# Altium schematic sheet Motion_Detector_Atmega64.SCHDOC
size 594 x 420 mm; SheetNumber: 1; SheetTotal: 1; DocumentName: Sheet1.SCHDOC
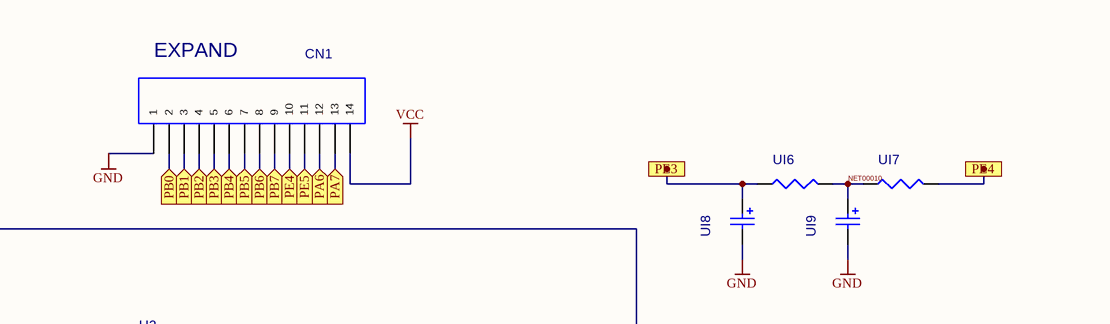
[diagram p0: Motion_Detector_Atmega64.SCHDOC, top right]
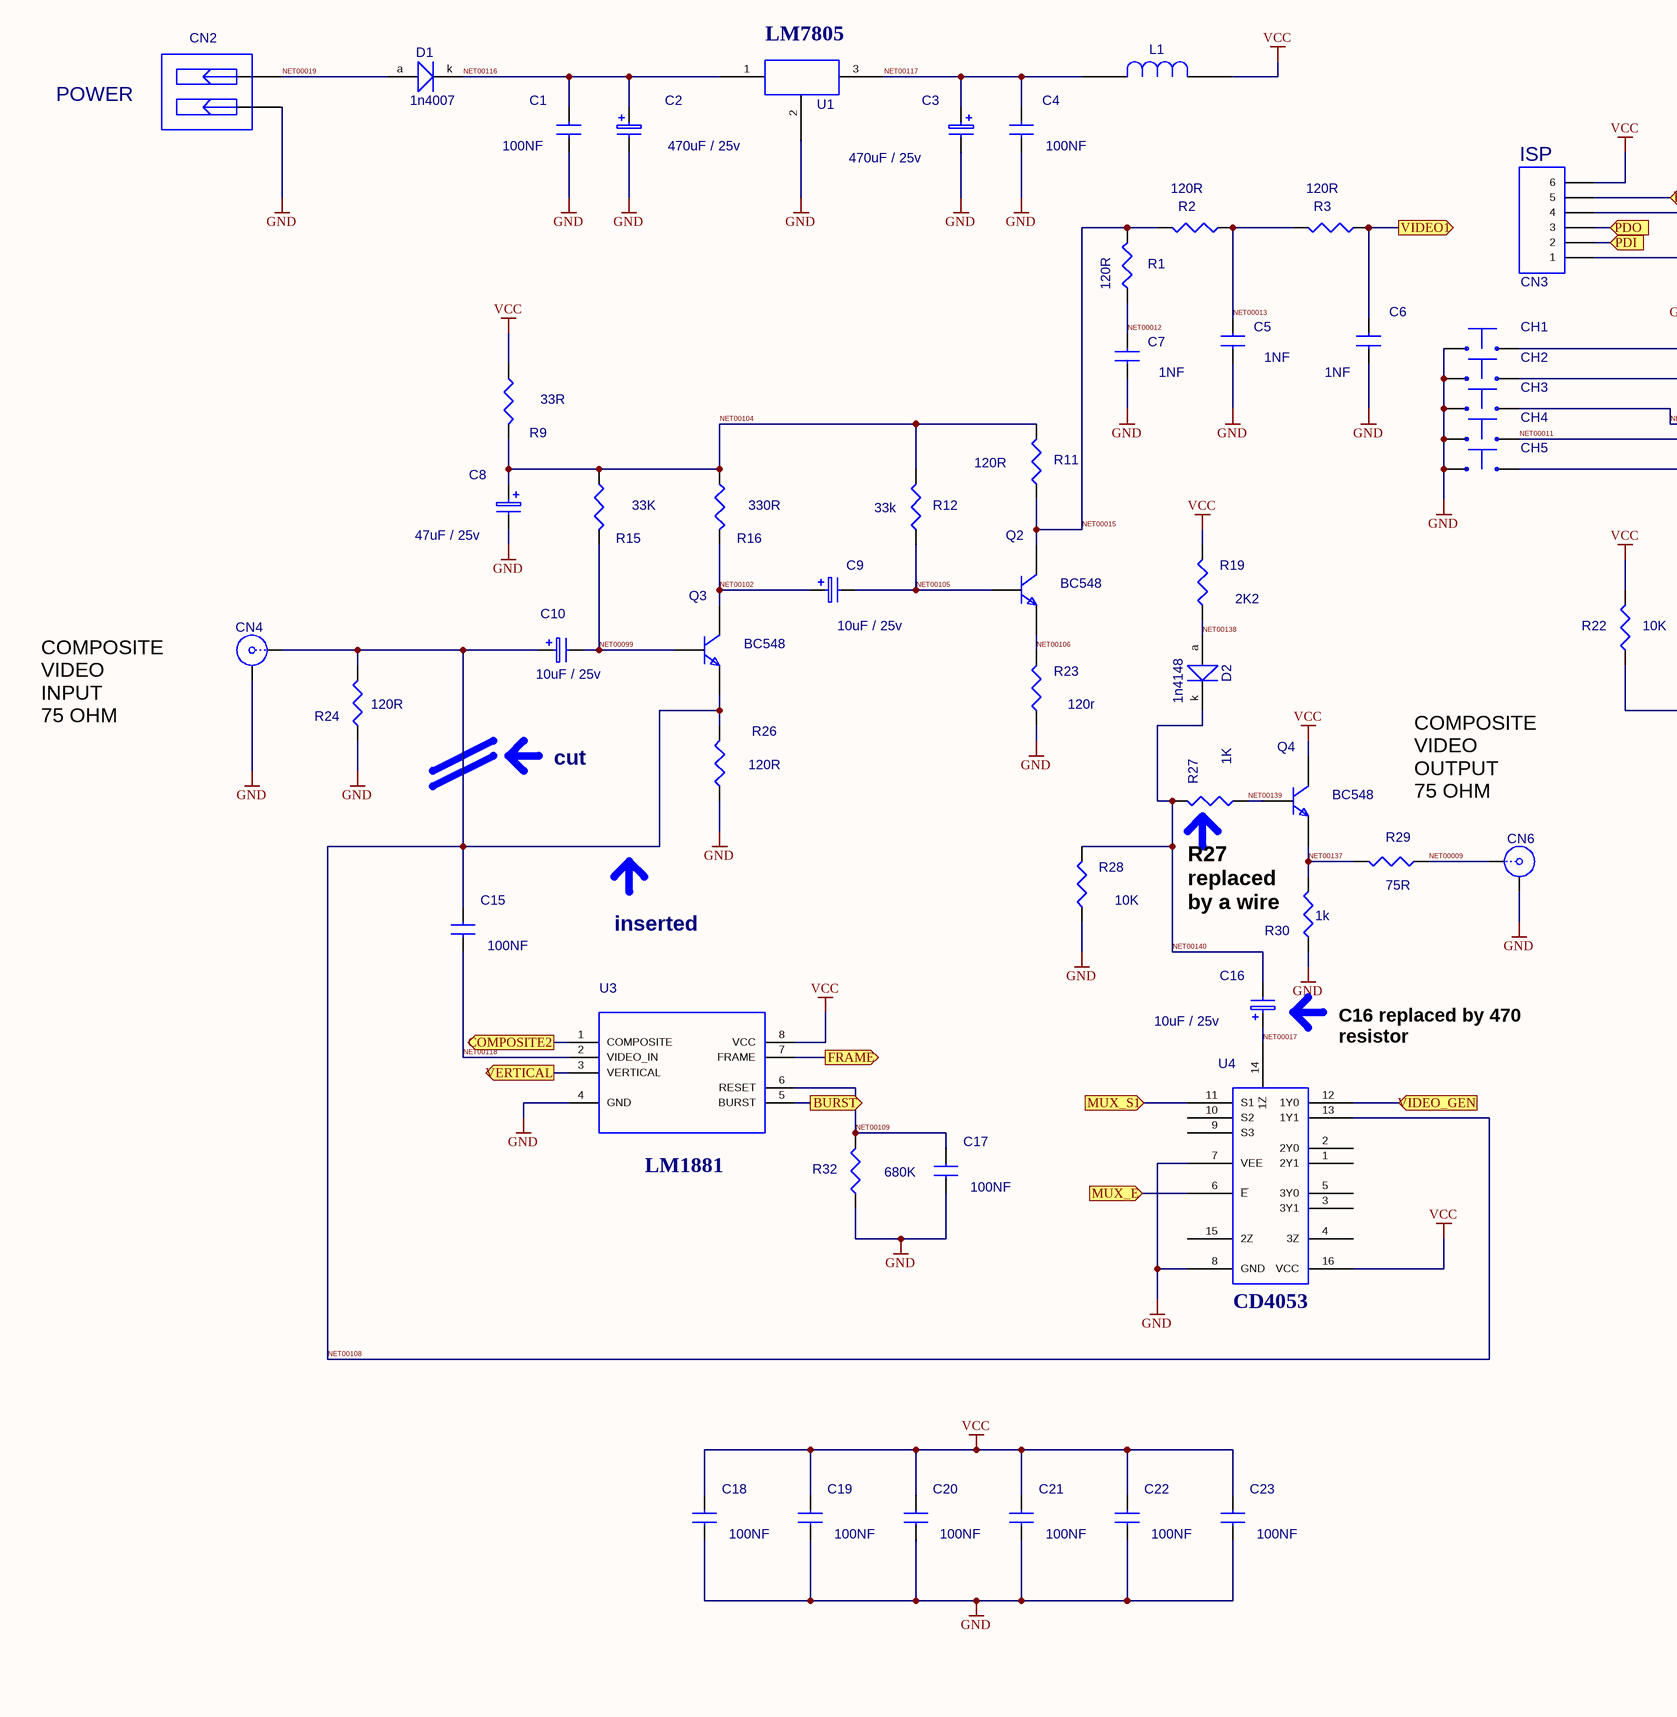
[diagram p1: Motion_Detector_Atmega64.SCHDOC, bottom left]
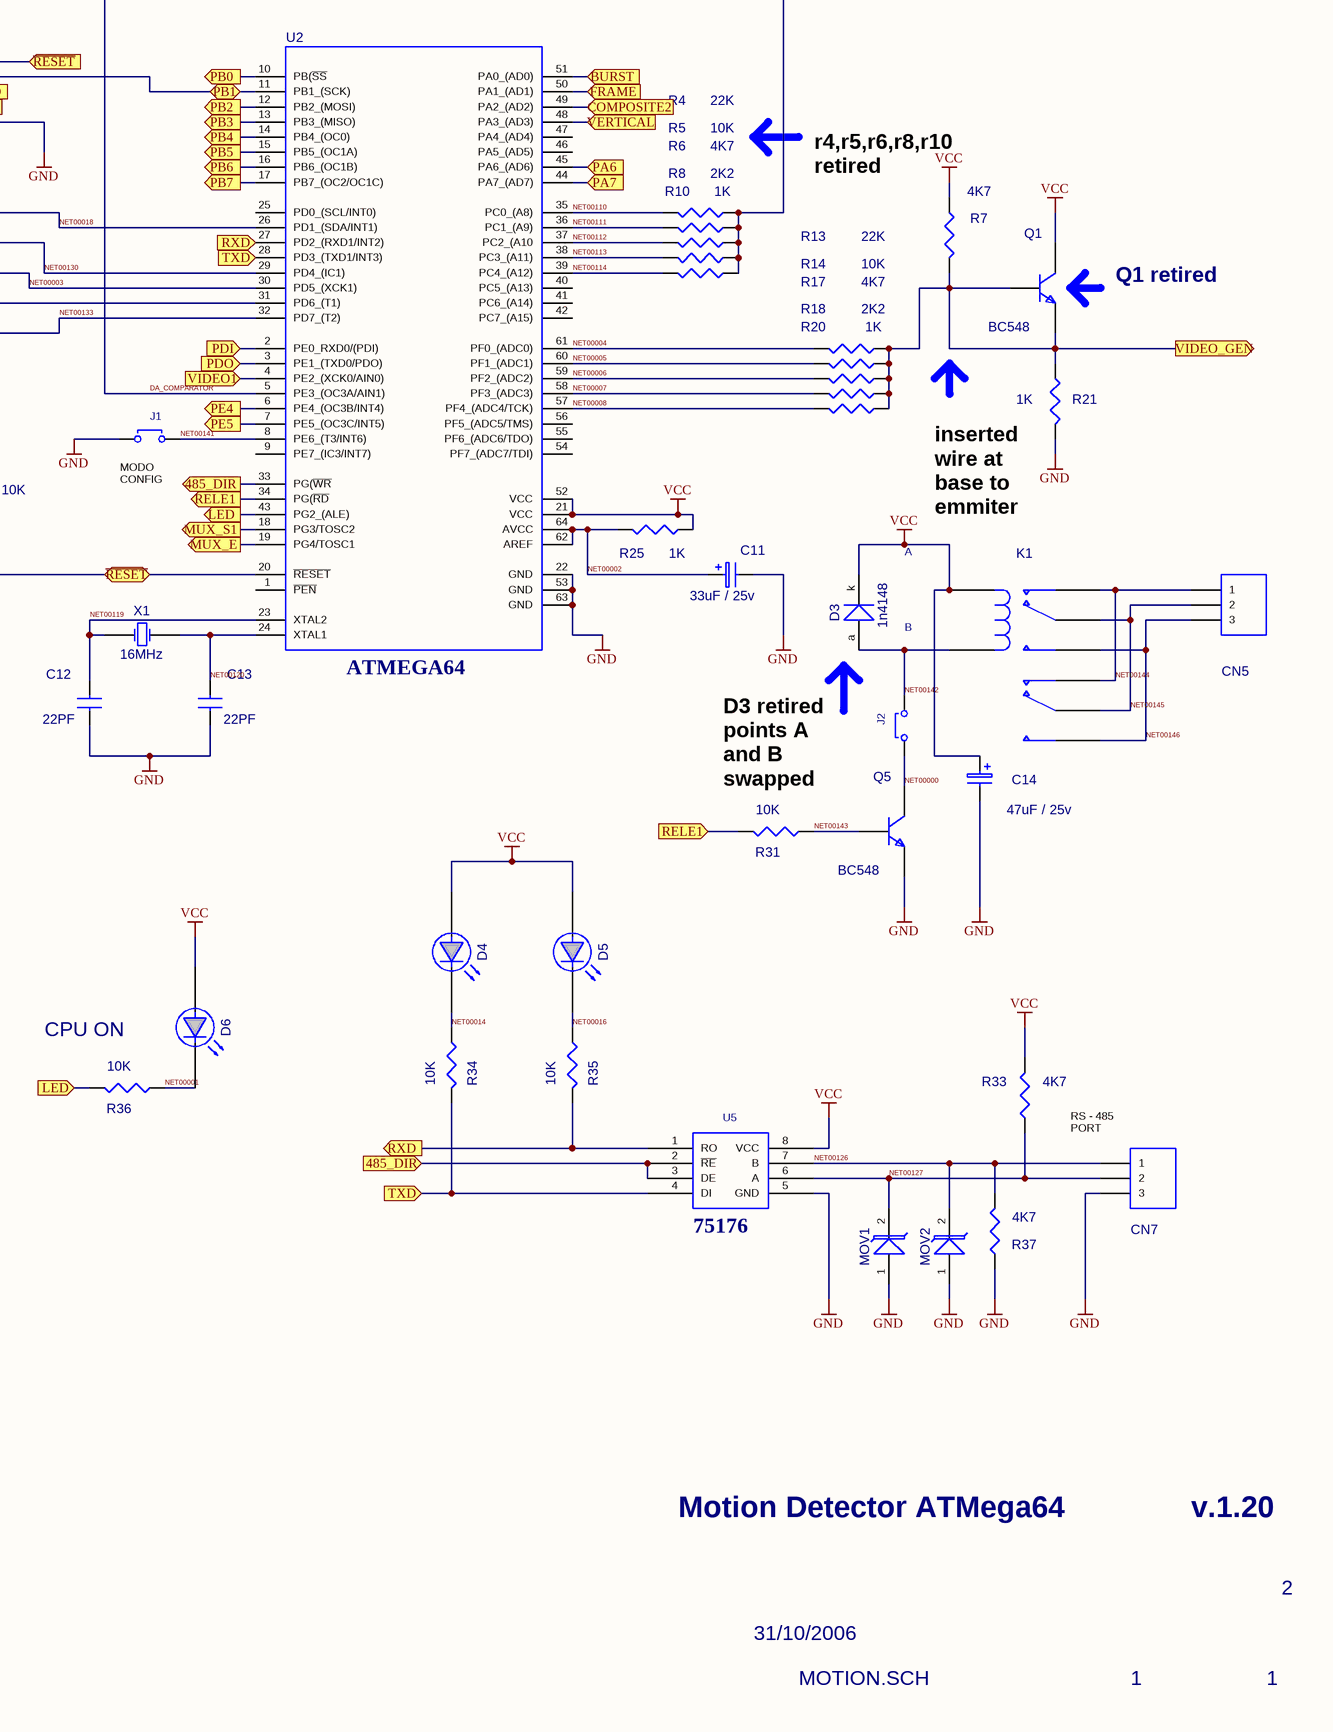
[diagram p2: Motion_Detector_Atmega64.SCHDOC, bottom right]

## Parts
C1  value 100NF  [CAP200_CAP1()]
C2  value 470uF / 25v  [POLCAP100_POLCAP100()]
C3  value 470uF / 25v  [POLCAP100_POLCAP100()]
C4  value 100NF  [CAP200_CAP1()]
C5  value 1NF  [CAP200_CAP1()]
C6  value 1NF  [CAP200_CAP1()]
C7  value 1NF  [CAP200_CAP1()]
C8  value 47uF / 25v  [CAP100RP_POLCAP10()]
C9  value 10uF / 25v  [CAP100RP_POLCAP10()]
C10  value 10uF / 25v  [CAP100RP_POLCAP10()]
C11  value 33uF / 25v  [CAP100RP_POLCAP10()]
C12  value 22PF  [CAP200_CAP1()]
C13  value 22PF  [CAP200_CAP1()]
C14  value 47uF / 25v  [CAP100RP_POLCAP10()]
C15  value 100NF  [CAP200_CAP1()]
C16  value 10uF / 25v  [CAP100RP_POLCAP10()]
C17  value 100NF  [CAP200_CAP1()]
C18  value 100NF  [CAP200_CAP1()]
C19  value 100NF  [CAP200_CAP1()]
C20  value 100NF  [CAP200_CAP1()]
C21  value 100NF  [CAP200_CAP1()]
C22  value 100NF  [CAP200_CAP1()]
C23  value 100NF  [CAP200_CAP1()]
CH1  (no value)  [PUSH_PUSH()]
CH2  (no value)  [PUSH_PUSH()]
CH3  (no value)  [PUSH_PUSH()]
CH4  (no value)  [PUSH_PUSH()]
CH5  (no value)  [PUSH_PUSH()]
CN1  (no value)  [HDR1X14_CON14PIN()]
CN2  (no value)  [BORNE2_BORNE2()]
CN3  (no value)  [HDR1X6_CON6PIN()]
CN4  (no value)  [BNC_RA CON_BNC()]
CN5  (no value)  [RELE OUT_BORNE3()]
CN6  (no value)  [BNC_RA CON_BNC()]
CN7  (no value)  [HDR1X3_CON3PINOS()]
D1  value 1n4007  [DIODE_VERT_DIODO()]
D2  value 1n4148  [DIODE_VERT_DIODO()]
D3  value 1n4148  [DIODE_VERT_DIODO()]
D4  (no value)  [LED3V_LED()]
D5  (no value)  [LED3V_LED()]
D6  (no value)  [LED3V_LED()]
J1  (no value)  [JUMPER_JUMPER()]
J2  (no value)  [JUMPER_JUMPER()]
K1  (no value)  [MINI_RELE_MINI_RELE()]
L1  (no value)  [RES400_INDUCTOR()]
MOV1  (no value)  [MOV_MOV()]
MOV2  (no value)  [MOV_MOV()]
Q1  value BC548  [BC337_BC337()]
Q2  value BC548  [BC337_BC337()]
Q3  value BC548  [BC337_BC337()]
Q4  value BC548  [BC337_BC337()]
Q5  value BC548  [BC337_BC337()]
R1  value 120R  [RES1_RES1()]
R2  value 120R  [RES1_RES1()]
R3  value 120R  [RES1_RES1()]
R4  value 22K  [RES1_RES1()]
R5  value 10K  [RES1_RES1()]
R6  value 4K7  [RES1_RES1()]
R7  value 4K7  [RES1_RES1()]
R8  value 2K2  [RES1_RES1()]
R9  value 33R  [RES1_RES1()]
R10  value 1K  [RES1_RES1()]
R11  value 120R  [RES1_RES1()]
R12  value 33k  [RES1_RES1()]
R13  value 22K  [RES1_RES1()]
R14  value 10K  [RES1_RES1()]
R15  value 33K  [RES1_RES1()]
R16  value 330R  [RES1_RES1()]
R17  value 4K7  [RES1_RES1()]
R18  value 2K2  [RES1_RES1()]
R19  value 2K2  [RES1_RES1()]
R20  value 1K  [RES1_RES1()]
R21  value 1K  [RES1_RES1()]
R22  value 10K  [RES1_RES1()]
R23  value 120r  [RES1_RES1()]
R24  value 120R  [RES1_RES1()]
R25  value 1K  [RES1_RES1()]
R26  value 120R  [RES1_RES1()]
R27  value 1K  [RES1_RES1()]
R28  value 10K  [RES1_RES1()]
R29  value 75R  [RES1_RES1()]
R30  value 1k  [RES1_RES1()]
R31  value 10K  [RES1_RES1()]
R32  value 680K  [RES1_RES1()]
R33  value 4K7  [RES1_RES1()]
R34  value 10K  [RES1_RES1()]
R35  value 10K  [RES1_RES1()]
R36  value 10K  [RES1_RES1()]
R37  value 4K7  [RES1_RES1()]
U1  (no value)  [7805_7805()]
U2  (no value)  [64A_ATMEGA64()]
U3  (no value)  [8P3_LM1881()]
U4  (no value)  [NSO16_4053()]
U5  (no value)  [8P3_75176()]
UI6  (no value)  [CR1608-0603_RES3()]
UI7  (no value)  [CR1608-0603_RES3()]
UI8  (no value)  [CC2012-0805_CAP_POL3()]
UI9  (no value)  [CC2012-0805_CAP_POL3()]
X1  value 16MHz  [XTAL_XTAL()]

## Ports
485_DIR (in), 485_DIR (out), BURST (in), BURST (out), COMPOSITE2 (in), COMPOSITE2 (out), FRAME (in), FRAME (out), LED (in), LED (out), MUX_E (in), MUX_E (out), MUX_S1 (in), MUX_S1 (out), PA6 (in), PA7 (in), PB0 (in), PB0 (out), PB1 (bidir), PB1 (in), PB2 (in), PB2 (out), PB3 (in), PB3 (out), PB4 (in), PB4 (out), PB5 (in), PB5 (out), PB6 (in), PB6 (out), PB7 (in), PB7 (out), PDI (in), PDO (in), PE3, PE4, PE4 (in), PE4 (out), PE5 (in), PE5 (out), RELE1 (in), RELE1 (out), RXD (in), RXD (out), TXD (in), VERTICAL (in), VERTICAL (out), VIDEO1 (in), VIDEO1 (out), VIDEO_GEN (in), VIDEO_GEN (out), ~{RESET} (bidir), ~{RESET} (in)

## Nets
GND: C1.2 C2.minus C3.minus C4.2 C5.2 C6.2 C7.2 C8.minus C11.minus C12.2 C13.2 C14.minus C17.2 C18.2 C19.2 C20.2 C21.2 C22.2 C23.2 CH1.1 CH2.1 CH3.1 CH4.1 CH5.1 CN1.1 CN2.2 CN3.1 CN4.2(Y) CN6.2(Y) CN7.3 J1.1 MOV1.1 MOV2.1 Q5.E R21.1 R23.2 R24.2 R26.2 R28.2 R30.2 R32.2 R37.2 U1.2 U2.22(GND) U2.53(GND) U2.63(GND) U3.4(GND) U4.7(VEE) U4.8(GND) U5.5(GND) UI8.2 UI9.2
VCC: C14.plus C18.1 C19.1 C20.1 C21.1 C22.1 C23.1 CN1.14 CN3.6 D3.k(K) D4.1(A) D5.1(A) D6.1(A) K1.L1 L1.2 Q1.C Q4.C R7.2 R9.2 R19.1 R22.1 R25.2 R33.1 U2.21(VCC) U2.52(VCC) U3.8(VCC) U4.16(VCC) U5.8(VCC)
485_DIR: U2.33(PG(~{WR}) U5.2(~{RE}) U5.3(DE) ; port 485_DIR
BURST: U2.51(PA0_(AD0)) U3.5(BURST) ; port BURST
COMPOSITE2: U2.49(PA2_(AD2)) U3.1(COMPOSITE) ; port COMPOSITE2
DA_COMPARATOR: R4.2 R5.2 R6.2 R8.2 R10.2 U2.5(PE3_(OC3A/AIN1))
FRAME: U2.50(PA1_(AD1)) U3.7(FRAME) ; port FRAME
LED: R36.1 U2.43(PG2_(ALE)) ; port LED
MUX_E: U2.19(PG4/TOSC1) U4.6(~{E}) ; port MUX_E
MUX_S1: U2.18(PG3/TOSC2) U4.11(S1) ; port MUX_S1
NET00000: J2.1 Q5.C
NET00001: D6.2(K) R36.2
NET00002: C11.plus R25.1 U2.62(AREF) U2.64(AVCC)
NET00003: CH3.2 U2.30(PD5_(XCK1))
NET00004: R13.1 U2.61(PF0_(ADC0))
NET00005: R14.1 U2.60(PF1_(ADC1))
NET00006: R17.1 U2.59(PF2_(ADC2))
NET00007: R18.1 U2.58(PF3_(ADC3))
NET00008: R20.1 U2.57(PF4_(ADC4/TCK))
NET00009: CN6.1(X) R29.2
NET00010: UI6.2 UI7.1 UI9.1
NET00011: CH4.2 U2.31(PD6_(T1))
NET00012: C7.1 R1.2
NET00013: C5.1 R2.2 R3.1
NET00014: D4.2(K) R34.2
NET00015: Q2.C R1.1 R2.1 R11.2
NET00016: D5.2(K) R35.2
NET00017: C16.plus U4.14(1Z)
NET00018: CH1.2 U2.26(PD1_(SDA/INT1))
NET00019: CN2.1 D1.a(A)
NET00099: C10.minus Q3.B R15.1
NET00102: C9.plus Q3.C R16.1
NET00104: C8.plus R9.1 R11.1 R12.1 R15.2 R16.2
NET00105: C9.minus Q2.B R12.2
NET00106: Q2.E R23.1
NET00108: C10.plus C15.1 CN4.1(X) Q3.E R24.1 R26.1 U4.13(1Y1)
NET00109: C17.1 R32.1 U3.6(RESET)
NET00110: R4.1 U2.35(PC0_(A8))
NET00111: R5.1 U2.36(PC1_(A9))
NET00112: R6.1 U2.37(PC2_(A10)
NET00113: R8.1 U2.38(PC3_(A11))
NET00114: R10.1 U2.39(PC4_(A12))
NET00116: C1.1 C2.plus D1.k(K) U1.1
NET00117: C3.plus C4.1 L1.1 U1.3
NET00118: C15.2 U3.2(VIDEO_IN)
NET00119: C12.1 U2.23(XTAL2) X1.1
NET00120: C13.1 U2.24(XTAL1) X1.2
NET00126: CN7.1 MOV2.2 R37.1 U5.7(B)
NET00127: CN7.2 MOV1.2 R33.2 U5.6(A)
NET00130: CH2.2 U2.29(PD4_(IC1))
NET00133: CH5.2 U2.32(PD7_(T2))
NET00137: Q4.E R29.1 R30.1
NET00138: D2.a(A) R19.2
NET00139: Q4.B R27.2
NET00140: C16.minus D2.k(K) R27.1 R28.1
NET00141: J1.2 U2.8(PE6_(T3/INT6))
NET00142: D3.a(A) J2.2 K1.L2
NET00143: Q5.B R31.2
NET00144: CN5.1 K1.NF1 K1.NF2
NET00145: CN5.2 K1.C1 K1.C2
NET00146: CN5.3 K1.NA1 K1.NA2
PA6: CN1.12 U2.45(PA6_(AD6)) ; port PA6
PA7: CN1.13 U2.44(PA7_(AD7)) ; port PA7
PB0: CN1.2 U2.10(PB(~{SS}) ; port PB0
PB1: CN1.3 CN3.4 U2.11(PB1_(SCK)) ; port PB1
PB2: CN1.4 U2.12(PB2_(MOSI)) ; port PB2
PB3: CN1.5 U2.13(PB3_(MISO)) ; port PB3
PB4: CN1.6 U2.14(PB4_(OC0)) ; port PB4
PB5: CN1.7 U2.15(PB5_(OC1A)) ; port PB5
PB6: CN1.8 U2.16(PB6_(OC1B)) ; port PB6
PB7: CN1.9 U2.17(PB7_(OC2/OC1C)) ; port PB7
PDI: CN3.2 U2.2(PE0_RXD0/(PDI)) ; port PDI
PDO: CN3.3 U2.3(PE1_(TXD0/PDO)) ; port PDO
PE4: CN1.10 U2.6(PE4_(OC3B/INT4)) ; port PE4
PE5: CN1.11 U2.7(PE5_(OC3C/INT5)) ; port PE5
~{RESET}: CN3.5 R22.2 U2.20(~{RESET}) ; port ~{RESET}
RELE1: R31.1 U2.34(PG(~{RD}) ; port RELE1
RXD: R35.1 U2.27(PD2_(RXD1/INT2)) U5.1(RO) ; port RXD
TXD: R34.1 U2.28(PD3_(TXD1/INT3)) U5.4(DI) ; port TXD
VERTICAL: U2.48(PA3_(AD3)) U3.3(VERTICAL) ; port VERTICAL
VIDEO1: C6.1 R3.2 U2.4(PE2_(XCK0/AIN0)) ; port VIDEO1
VIDEO_GEN: Q1.B Q1.E R7.1 R13.2 R14.2 R17.2 R18.2 R20.2 R21.2 U4.12(1Y0) ; port VIDEO_GEN
NetUI6_1: UI6.1 UI8.1

Not connected (* = marked no-connect by the designer): U2 1(~{PEN}) 9(PE7_(IC3/INT7)) 25(PD0_(SCL/INT0)) 40(PC5_(A13)) 41(PC6_(A14)) 42(PC7_(A15)) 46(PA5_(AD5)) 47(PA4_(AD4)) 54(PF7_(ADC7/TDI)) 55(PF6_(ADC6/TDO)) 56(PF5_(ADC5/TMS)); U4 1(2Y1) 2(2Y0) 3(3Y1) 4(3Z) 5(3Y0) 9(S3) 10(S2) 15(2Z); UI7 2

## Notes on the sheet
- EXPAND
- (near U1) LM7805
- POWER
- (near CN3) ISP
- r4,r5,r6,r8,r10
  retired
- Q1 retired
- (near J1) MODO
  CONFIG
- inserted
  wire at
  base to
  emmiter
- A
- COMPOSITE
  VIDEO
  INPUT
  75 OHM
- cut
- (near D3) B
- COMPOSITE
  VIDEO
  OUTPUT
  75 OHM
- (near U2) ATMEGA64
- (near R27) R27
  replaced
  by a wire
- D3 retired
  points A
  and B
  swapped
- inserted
- C16 replaced by 470
  resistor
- (near U3) LM1881
- (near R36) CPU ON
- RS - 485
  PORT
- (near U4) CD4053
- (near U5) 75176
- Motion Detector ATMega64
- v.1.20
- 2
- 31/10/2006
- MOTION.SCH
- 1
- C
- D
- E
- F
- 3
- 4
- Title
- Size
- A2
- Number
- Rev
- Date
- Filename
- Drawn by
- Sheet
- of

## Library data of the parts
C1 C4-C7 C17-C23 = CAP1: ComponentField6: Published 8-Jun-2000; OriginalName: CAP1
C2 C3 = POLCAP100
C8-C11 C14 C16 = POLCAP10
C12 C13 C15 = CAP1
CH1-CH5 = PUSH: Value: *
CN1 = CON14PIN: Value: *
CN2 = BORNE2: Value: *
CN3 = CON6PIN: Value: *
CN4 CN6 = BNC: Value: *; LatestRevisionDate: 17-Jul-2002; LatestRevisionNote: Re-released for DXP Platform.; Publisher: Altium Limited
CN5 = BORNE3
CN7 = CON3PINOS: Value: *
D1-D3 = DIODO
D4-D6 = LED: Value: *
J1 J2 = JUMPER: Value: *
K1 = MINI_RELE: Value: *
L1 = INDUCTOR
MOV1 MOV2 = MOV: Value: *
Q1-Q5 = BC337: OriginalName: NPN; ComponentField6: Published 8-Jun-2000
R1-R37 = RES1: ComponentField6: Published 8-Jun-2000; OriginalName: RES1
U1 = 7805: Value: *
U2 = ATMEGA64: Value: *
U3 = LM1881: Value: *
U4 = 4053: Value: *
U5 = 75176: Value: *
UI6 UI7 = RES3: Value: 1K; Published: 8-Jun-2000; LatestRevisionDate: 4-Mar-2005; LatestRevisionNote: PCB Footprint replaced.; Publisher: Altium Limited
UI8 UI9 = CAP_POL3: Value: 100pF; Published: 8-Jun-2000; LatestRevisionDate: 17-Jul-2002; LatestRevisionNote: Re-released for DXP Platform.; PackageReference: C0805; Publisher: Altium Limited
X1 = XTAL: ComponentField6: Published 8-Jun-2000; OriginalName: XTAL